# EAGLE design 2_10decoder1-2 (EAGLE 8.7.0)
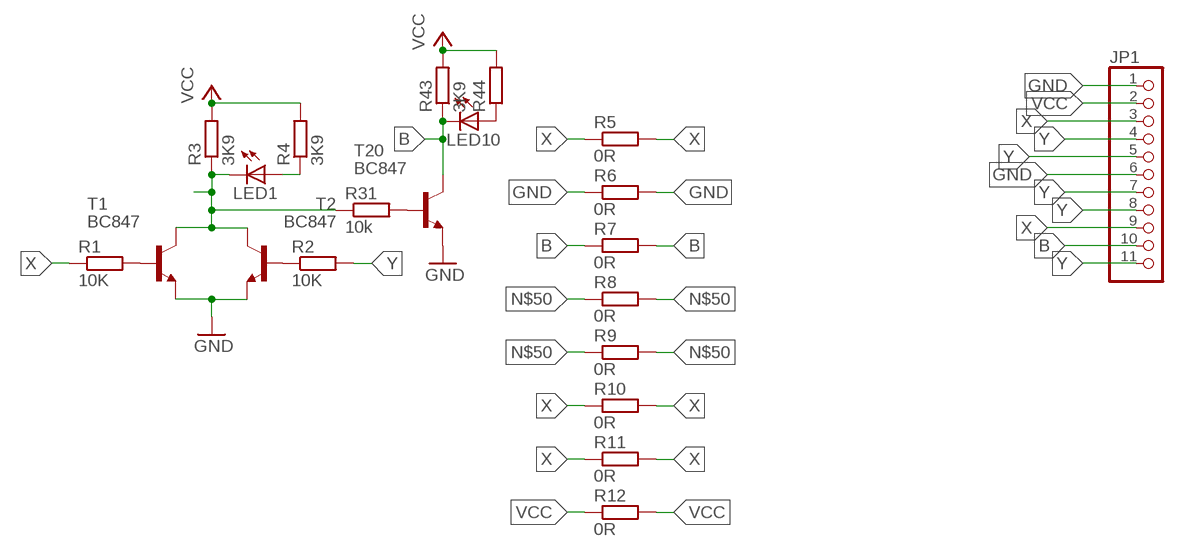
[diagram p0: schematic, sheet 1]

## Parts
JP1  PINHD-1X11_2.54-SMD-90°  [1X11SMD/90]
LED1  LEDCHIP-LED0805  [CHIP-LED0805]
LED10  LEDCHIP-LED0805  [CHIP-LED0805]
R1  10K  R-EU_M0805  [M0805]
R2  10K  R-EU_M0805  [M0805]
R3  3K9  R-EU_M0805  [M0805]
R4  3K9  R-EU_M0805  [M0805]
R5  0R  R-EU_M1206  [M1206]
R6  0R  R-EU_M1206  [M1206]
R7  0R  R-EU_M1206  [M1206]
R8  0R  R-EU_M1206  [M1206]
R9  0R  R-EU_M1206  [M1206]
R10  0R  R-EU_M1206  [M1206]
R11  0R  R-EU_M1206  [M1206]
R12  0R  R-EU_M1206  [M1206]
R31  10k  R-EU_M0805  [M0805]
R43  3K9  R-EU_M0805  [M0805]
R44  R-EU_M0805  [M0805]
T1  BC847  [SOT23]
T2  BC847  [SOT23]
T20  BC847  [SOT23]

## Nets
B: JP1.10 LED10.C R7.1 R7.2 R43.1 T20.3(C)
GND: JP1.1 JP1.6 R6.1 R6.2 T1.2(E) T2.2(E) T20.2(E)
N$1: R1.2 T1.1(B)
N$2: R2.1 T2.1(B)
N$6: LED1.A R4.1
N$35: R31.2 T20.1(B)
N$49: LED10.A R44.1
N$50: LED1.C R3.1 R8.1 R8.2 R9.1 R9.2 R31.1 T1.3(C) T2.3(C)
VCC: JP1.2 R3.2 R4.2 R12.1 R12.2 R43.2 R44.2
X: JP1.3 JP1.9 R1.1 R5.1 R5.2 R10.1 R10.2 R11.1 R11.2
Y: JP1.4 JP1.5 JP1.7 JP1.8 JP1.11 R2.2

## Library data of the parts
JP1 = pinhead-2:PINHD-1X11: PIN HEADER
LED1 LED10 = led:LED: LED OSRAM: - CHIPLED LG R971, LG N971, LY N971, LG Q971, LY Q971, LO R971, LY R971 LH N974, LH R974 LS Q976, LO Q976, LY Q976 LO Q996 - Hyper CHIPLED LW Q18S LB Q993, LB Q99A, LB R99A - SideLED LS A670, LO A670, LY A670, LG A670, LP A670 LB A673, LV A673, LT A673, LW A673 LH A674 LY A675 LS A676, LA A676, LO A676, LY A676, LW A676 LS A679, LY A679, LG A679 - Hyper Micro SIDELED® LS Y876, LA Y876, LO Y876, LY Y876 LT Y87S - SmartLED LW L88C, LW L88S LB L89C, LB L89S, LG L890 LS L89K, LO L89K, LY L89K LS L896, LA L896, LO L896, LY L896 - TOPLED LS T670, LO T670, LY T670, LG T670, LP T670 LSG T670, LSP T670, LSY T670, LOP T670, LYG T670 LG T671, LOG T671, LSG T671 LB T673, LV T673, LT T673, LW T673 LH T674 LS T676, LA T676, LO T676, LY T676, LB T676, LH T676, LSB T676, LW T676 LB T67C, LV T67C, LT T67C, LS T67K, LO T67K, LY T67K, LW E67C LS E67B, LA E67B, LO E67B, LY E67B, LB E67C, LV E67C, LT E67C LW T67C LS T679, LY T679, LG T679 LS T770, LO T770, LY T770, LG T770, LP T770 LB T773, LV T773, LT T773, LW T773 LH T774 LS E675, LA E675, LY E675, LS T675 LS T776, LA T776, LO T776, LY T776, LB T776 LHGB T686 LT T68C, LB T68C - Hyper Mini TOPLED® LB M676 - Mini TOPLED Santana® LG M470 LS M47K, LO M47K, LY M47K Source: http://www.osram.convergy.de LUXEON: - LUMILED® LXK2-PW12-R00, LXK2-PW12-S00, LXK2-PW14-U00, LXK2-PW14-V00 LXK2-PM12-R00, LXK2-PM12-S00, LXK2-PM14-U00 LXK2-PE12-Q00, LXK2-PE12-R00, LXK2-PE12-S00, LXK2-PE14-T00, LXK2-PE14-U00 LXK2-PB12-K00, LXK2-PB12-L00, LXK2-PB12-M00, LXK2-PB14-N00, LXK2-PB14-P00, LXK2-PB14-Q00 LXK2-PR12-L00, LXK2-PR12-M00, LXK2-PR14-Q00, LXK2-PR14-R00 LXK2-PD12-Q00, LXK2-PD12-R00, LXK2-PD12-S00 LXK2-PH12-R00, LXK2-PH12-S00 LXK2-PL12-P00, LXK2-PL12-Q00, LXK2-PL12-R00 Source: www.luxeon.com KINGBRIGHT: KA-3528ASYC Source: www.kingbright.com
R1-R4 R31 R43 R44 = resistor:R-EU_: RESISTOR, European symbol
R5-R12 = rcl:R-EU_: RESISTOR, European symbol; SPICEPREFIX: R
T1 T2 T20 = transistor-neu-to92:BC847: NPN TRANSISTOR

## Board
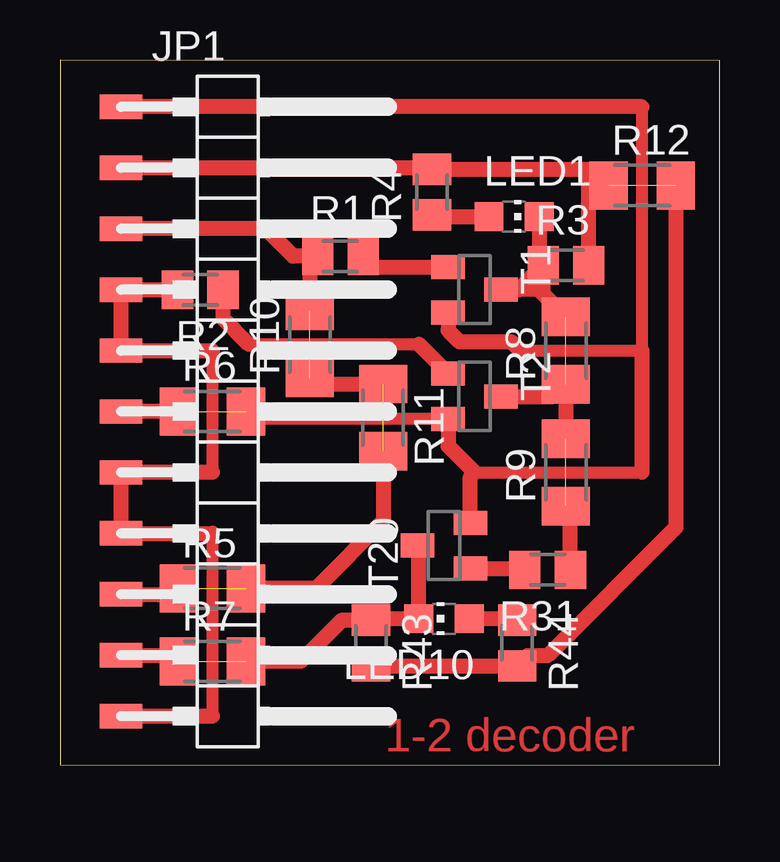
[diagram p1: board, top side]

Size 27.49 x 29.41 mm. Coordinates in mm from the lower left corner, seen from the top.
Outline: 0,0.03 27.49,0 27.49,29.39 0,29.41 0,0.03
Copper layers (1*16): Top 0.035mm / dielectric 1.5mm / Bottom 0.035mm
Design rules "default *": minimum track width 20mil, minimum drill 0.35mm, track to track 20mil, track to pad 20mil, pad to pad 20mil, via to via 20mil, smd to smd 6mil, copper to edge 40mil, drill to drill 6mil, minimum pad ring 10mil, minimum via ring 8mil, stop-mask expansion 4mil, vias tented up to drill 0mil, thermal gap 10mil

### Footprints (pad centres in the part's own frame; a part is rotated, then mirrored left to right if it is on the bottom)
1X11SMD/90 = smd 1.016 x 1.778: 1 -1.27,-5.08; 2 1.27,-5.08; 3 3.81,-5.08; 4 6.35,-5.08; 5 8.89,-5.08; 6 11.43,-5.08; 7 13.97,-5.08; 8 16.51,-5.08; 9 19.05,-5.08; 10 21.59,-5.08; 11 24.13,-5.08
CHIP-LED0805 = smd 1.2 x 1.2: A 0,-1.05; C 0,1.05
M0805 = smd 1.3 x 1.6: 1 -0.95,0; 2 0.95,0
M1206 = smd 1.6 x 2: 1 -1.4,0; 2 1.4,0
SOT23 = smd 1 x 1.4: 1 -0.95,-1.1; 2 0.95,-1.1; 3 0,1.1

### Placement (x,y rotation side)
JP1  7.62,26.19 270 top
LED1  18.92,22.89 270 top
LED10  16,6.12 90 top
R1  11.68,21.23 0 top
R2  5.84,19.84 180 top
R3  21.08,20.85 0 top
R4  15.49,23.9 90 top
R5  6.35,7.39 0 top
R6  6.35,14.76 0 top
R7  6.35,4.34 0 top
R8  21.08,17.3 90 top
R9  21.08,12.22 90 top
R10  10.41,17.55 90 top
R11  13.46,14.5 270 top
R12  24.26,24.18 0 top
R31  20.32,8.15 180 top
R43  12.95,5.11 270 top
R44  19.05,5.11 270 top
T1  17.27,19.84 270 top
T2  17.27,15.39 270 top
T20  16,9.17 90 top

### Tracks (layer width: path | path; a pad name or v marks a point on that pad's centre or on a via)
B  (2 unrouted)
  Top 0.635: JP1.10 4.57,4.6 | 4.57,4.6 4.83,4.85 | 4.57,4.6 4.7,4.6 | R7.2 10.03,4.34 11.74,6.06 R43.1 13.02,6.12 LED10.C 14.95,9.12 T20.3
GND  (1 unrouted)
  Top 0.508: 19.18,17.3 24.26,17.3 24.26,27.46 | 17.27,12.22 24.26,12.22 | T2.2 7.81,14.44
  Top 0.635: R6.1 JP1.6 | T1.2 16.17,18.13 16.64,17.67 18.81,17.67 19.18,17.3 | 24.26,27.46 JP1.1 | T2.2 16.17,13.32 17.27,12.22 17.1,12.05 T20.2 | 24.26,12.22 24.26,17.3 | 7.81,14.44 R6.2
N$1
  Top 0.635: R1.2 13.08,20.79 T1.1
N$2
  Top 0.508: 14.96,17.55 7.87,17.55
  Top 0.635: T2.1 14.96,17.55 | 7.87,17.55 6.79,18.63 R2.1
N$6
  Top 0.635: R4.1 15.56,22.89 LED1.A
N$35
  Top 0.635: T20.1 19.3,8.22 R31.2
N$49
  Top 0.635: R44.1 18.98,6.12 LED10.A
N$50  (2 unrouted)
  Top 0.635: R8.1 21.08,15.39 | R31.1 21.27,10.63 R9.1 | T2.3 20.58,15.39 R8.1 | R8.1 R9.2 | LED1.C 19.97,21.01 R3.1 | R3.1 19.12,19.84 T1.3 19.94,19.84 R8.2 20.13,19.65 R3.1
VCC  (1 unrouted)
  Top 0.635: JP1.2 15.43,24.92 R4.2 22.19,24.85 | R43.2 R44.2 19.47,4.58 20.31,4.58 25.66,9.92 R12.2 | 22.19,24.85 R12.1 22.03,23.36 R3.2 22.03,24.7 22.19,24.85
X  (3 unrouted)
  Top 0.635: JP1.3 8.57,22.38 9.72,21.23 R1.1 10.41,21.17 R10.2 | R10.1 10.41,15.9 R11.1 | R11.2 13.46,10.19 10.67,7.39 R5.2 | JP1.9 4.7,7.14 R5.1
Y
  Top 0.508: 6.35,17.3 6.35,12.22 | 6.35,9.68 6.35,4.6 6.35,2.06
  Top 0.635: 6.35,17.3 JP1.5 JP1.4 R2.2 | 6.35,12.22 JP1.7 JP1.8 6.35,9.68 | 6.35,2.06 JP1.11

### Text on the board
Top: 1-2 decoder